# Altium project PCB_BTL.PrjPcb
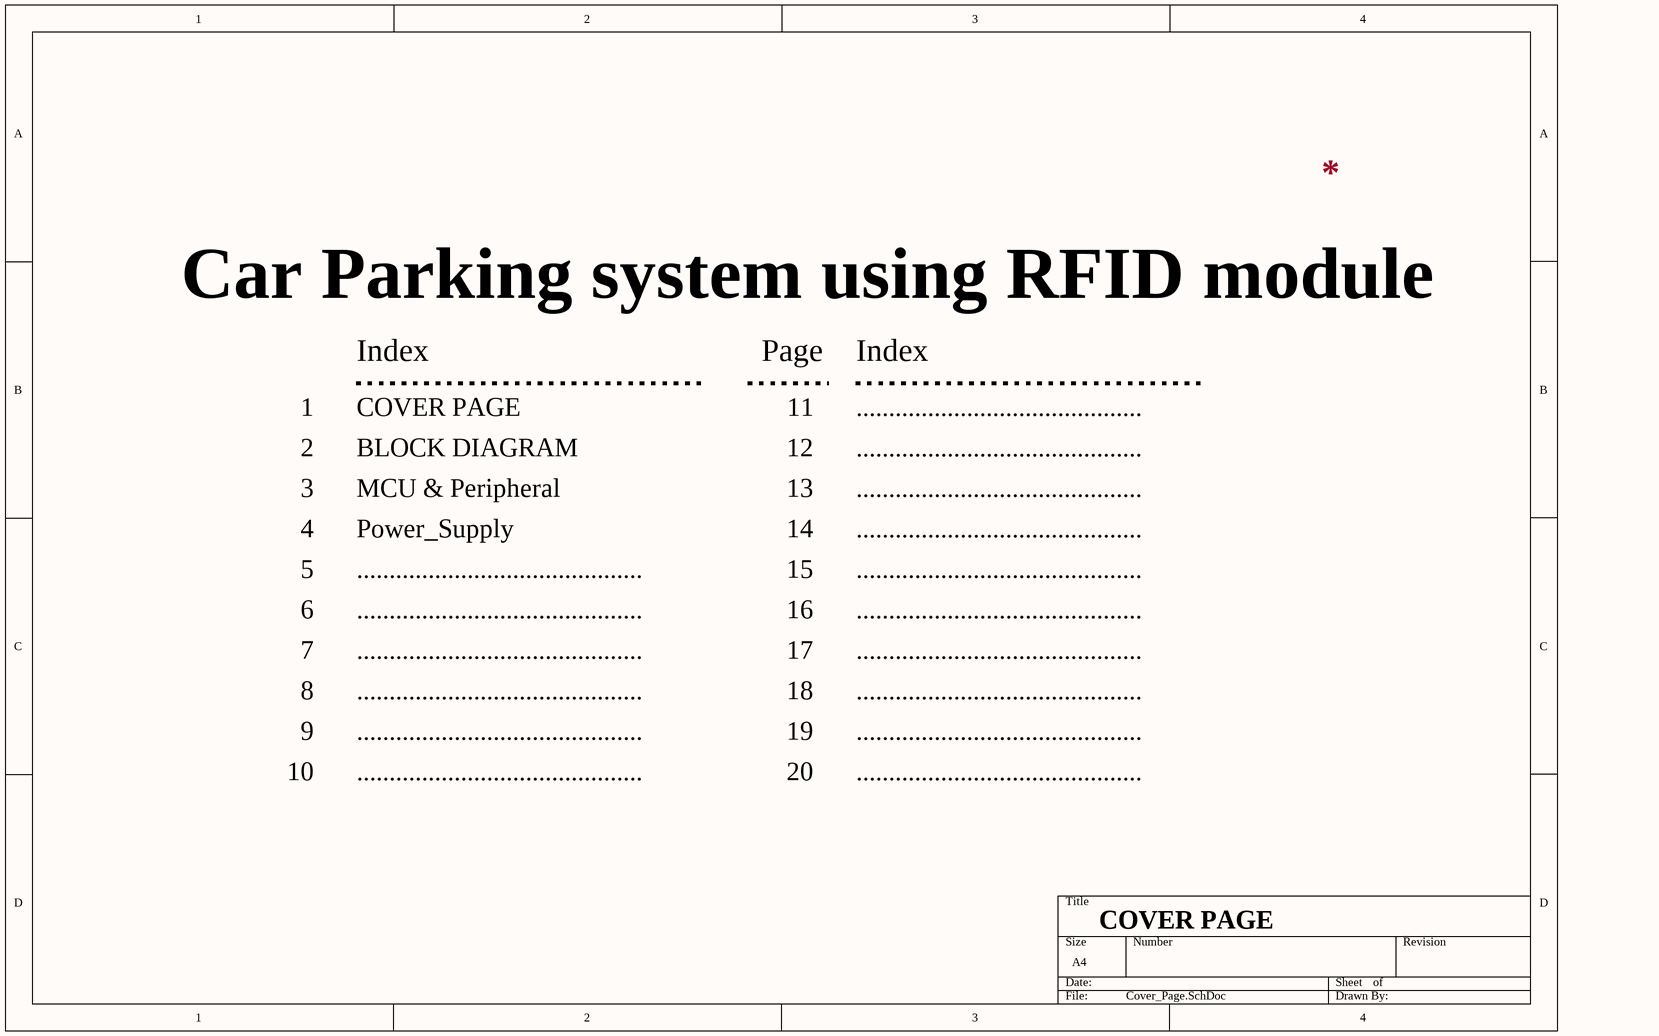
[diagram p0: Cover_Page.SchDoc]
3 sheets, 50 parts. Net scope: global (net labels, ports and power ports of the same name join across sheets).
Board file: BTL.PcbDoc
Sheets:
  Cover_Page.SchDoc
  MCU & Peripherals.SchDoc
  Power Supply.SchDoc

## Sheet Cover_Page.SchDoc
size A4; SheetNumber: 1; SheetTotal: 4

### Notes on the sheet
- Car Parking system using RFID module
- Index
- Page
- 1
- COVER PAGE
- 11
- ............................................
- 2
- 3
- BLOCK DIAGRAM
- MCU & Peripheral
- 12
- 13
- 4
- 5
- Power_Supply
- 14
- 15
- 6
- 16
- 7
- 8
- 17
- 18
- 9
- 10
- 19
- 20

## Sheet MCU & Peripherals.SchDoc: STM32 Blue Pill
size A3; ApprovedBy: Bui Quoc Bao; SheetNumber: 3; SheetTotal: 4; SPICEModelCacheVQOZSIKY: <root> / <DocumentId>VQOZSIKY</DocumentId> / <CacheFrame Number="0"> / <Model Name="0805_885012207072_100nf" Kind="CKT"> / <Text>******* / .subckt 0805_885012207072_100nF 1 2 / Rser 1 3 0.0172819633028 / Lser 2 4 0.00000000035 / C1 3 4 0.0000001 / Rpar 3 4 5000000000 / .ends 0805_885012207072_100nF</Text> / </Model> / <Model Name="0805_885012007030_22pf" Kind="CKT"> / <Text>******* / .subckt 0805_885012007030_22pF 1 2 / Rser 1 3 0.337501541959 / Lser 2 4 6.08362599E-10 / C1 3 4 0.000000000022 / Rpar 3 4 10000000000 / .ends 0805_885012007030_22pF</Text> / </Model> / <Model Name="0805_885012107015_1uf" Kind="CKT"> / <Text>******* / .subckt 0805_885012107015_1uF 1 2 / Rser 1 3 0.00799934804354 / Lser 2 4 2.55135429E-10 / C1 3 4 0.000001 / Rpar 3 4 500000000 / .ends 0805_885012107015_1uF</Text> / </Model> / <Model Name="0805_885012207068_22nf" Kind="CKT"> / <Text>******* / .subckt 0805_885012207068_22nF 1 2 / Rser 1 3 0.0486328028818 / Lser 2 4 0.00000000041 / C1 3 4 0.000000022 / Rpar 3 4 10000000000 / .ends 0805_885012207068_22nF</Text> / </Model> / </CacheFrame> / </root>
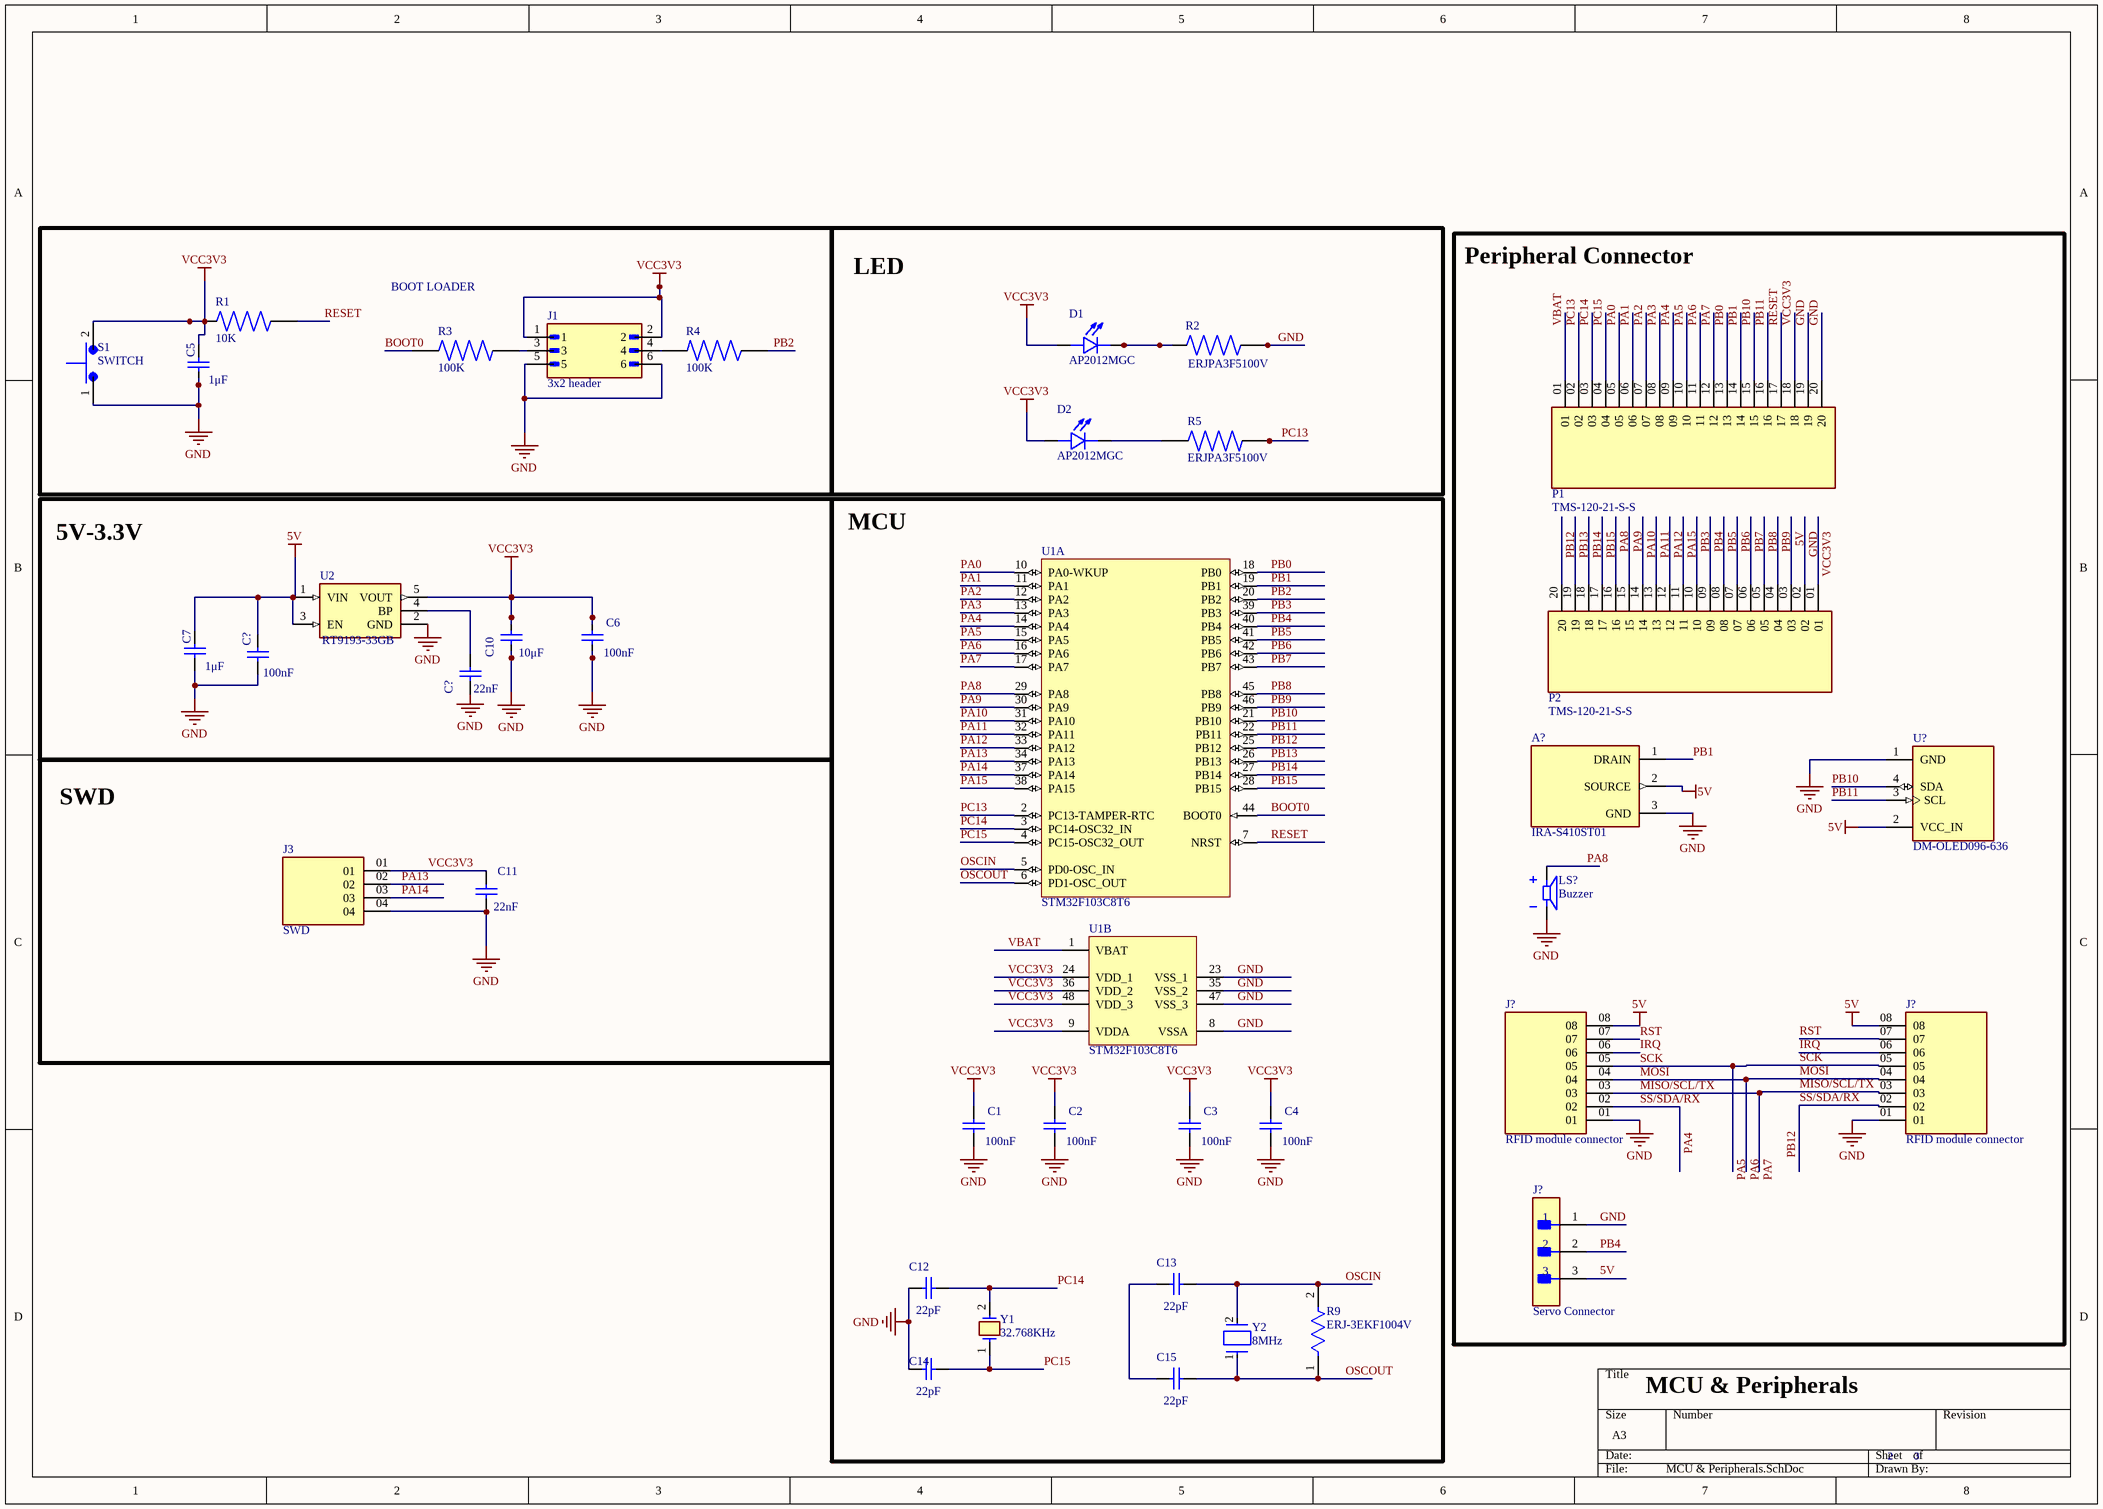
[diagram p1: MCU & Peripherals.SchDoc]

### Parts
(Parts that share a designator on the sheet are numbered #1, #2 ... from top to bottom, then left to right.)
A?  IRA-S410ST01  [TO254P940H490-3]
C1  100nF  [WCAP-CSGP_0805_L2W1.25H0.8_Reflow]
C2  100nF  [WCAP-CSGP_0805_L2W1.25H0.8_Reflow]
C3  100nF  [WCAP-CSGP_0805_L2W1.25H0.8_Reflow]
C4  100nF  [WCAP-CSGP_0805_L2W1.25H0.8_Reflow]
C5  1μF  [WCAP-CSGP_0805_L2W1.25H1.25]
C6  100nF  [WCAP-CSGP_0805_L2W1.25H0.8_Reflow]
C7  1μF  [WCAP-CSGP_0805_L2W1.25H1.25]
C10  10μF  [WCAP-CSGP_0805_L2W1.25H1.25]
C11  22nF  [WCAP-CSGP_0805_L2W1.25H0.8_Reflow]
C12  22pF  [WCAP-CSGP_0805_L2W1.25H0.6_Reflow]
C13  22pF  [WCAP-CSGP_0805_L2W1.25H0.6_Reflow]
C14  22pF  [WCAP-CSGP_0805_L2W1.25H0.6_Reflow]
C15  22pF  [WCAP-CSGP_0805_L2W1.25H0.6_Reflow]
C?#1  100nF  [WCAP-CSGP_0805_L2W1.25H0.8_Reflow]
C?#2  22nF  [WCAP-CSGP_0805_L2W1.25H0.8_Reflow]
D1  AP2012MGC  [LED_AP2012MGC]
D2  AP2012MGC  [LED_AP2012MGC]
J1  3x2 header  [HARWIN_M20-9980346]
J3  SWD  [SAMTEC_TSW-204-16-G-S-RA]
J?#1  RFID module connector  [SAMTEC_SL-108-T-19]
J?#2  RFID module connector  [SAMTEC_SL-108-T-19]
J?#3  Servo Connector  [FP-M22-2010305-MFG]
LS?  Buzzer  [XDCR_CMI-1210-5-95T]
P1  TMS-120-21-S-S  [SAMTEC_TMS-120-21-S-S]
P2  TMS-120-21-S-S  [SAMTEC_TMS-120-21-S-S]
R1  10K  [RESC2012X60N]
R2  ERJPA3F5100V  [RES_ERJPA3F5100V]
R3  100K  [RESC2012X60N]
R4  100K  [RESC2012X60N]
R5  ERJPA3F5100V  [RES_ERJPA3F5100V]
R9  ERJ-3EKF1004V  [FP-ERJ3EK-IPC_C]
S1  SWITCH  [SW_TS10-63-26-BE-250-SMT-TR]
U1  STM32F103C8T6  [STM-LQFP48_L]  (parts A,B of 2)
U2  RT9193-33GB  [SOT94P279X129-5N]
U?#1  DM-OLED096-636  [MODULE_DM-OLED096-636]
Y1  32.768KHz  [XTAL_NX3215SA-32.768K-STD-MUA-14]
Y2  8MHz  [FP-ABLS-MFG]

### Blocks framed on the sheet
BOOT LOADER: C5 J1 R1 R3 R4 S1
LED: D1 D2 R2 R5
Peripheral Connector: A? J?#1-J?#3 LS? P1 P2 U?#1
5V-3.3V: C6 C7 C10 C?#1 C?#2 U2
MCU: C1-C4 C12-C15 R9 U1 Y1 Y2
SWD: C11 J3

### Nets
5V: A?.2(SOURCE) C7.2 C?#1.2 J?#1.08 J?#2.08 P2.03 U2.1(VIN) U2.3(EN) U?#1.2(VCC_IN)
GND: A?.3(GND) C1.1 C2.1 C3.1 C4.1 C5.1 C6.1 C7.1 C10.1 C11.1 C12.1 C14.1 C?#1.1 J1.5 J1.6 J3.04 J?#1.01 J?#2.01 J?#3.1 LS?.N P1.19 P1.20 P2.02 R2.2 S1.1 U1.8(VSSA) U1.23(VSS_1) U1.35(VSS_2) U1.47(VSS_3) U2.2(GND) U?#1.1(GND)
VCC3V3: C1.2 C2.2 C3.2 C4.2 C5.2 C6.2 C10.2 C11.2 D1.A D2.A J1.1 J1.2 J3.01 P1.18 P2.01 R1.2 S1.2 U1.9(VDDA) U1.24(VDD_1) U1.36(VDD_2) U1.48(VDD_3) U2.5(VOUT)
BOOT0: R3.1 U1.44(BOOT0)
IRQ: J?#1.06 J?#2.06
MISO/SCL/TX: J?#1.03 J?#2.03 P1.12 U1.17(PA7)  [also labelled PA7]
MOSI: J?#1.04 J?#2.04 P1.11 U1.16(PA6)  [also labelled PA6]
OSCIN: C13.2 R9.2 U1.5(PD0-OSC_IN) Y2.2
OSCOUT: C15.2 R9.1 U1.6(PD1-OSC_OUT) Y2.1
PA0: P1.05 U1.10(PA0-WKUP)
PA1: P1.06 U1.11(PA1)
PA2: P1.07 U1.12(PA2)
PA3: P1.08 U1.13(PA3)
PA4: J?#1.02 J?#2.02 P1.09 P2.20 U1.14(PA4) U1.25(PB12)  [also labelled PB12, SS/SDA/RX]
PA5: J?#1.05 J?#2.05 P1.10 U1.15(PA5)  [also labelled SCK]
PA8: LS?.P P2.16 U1.29(PA8)
PA9: P2.15 U1.30(PA9)
PA10: P2.14 U1.31(PA10)
PA11: P2.13 U1.32(PA11)
PA12: P2.12 U1.33(PA12)
PA13: J3.02 U1.34(PA13)
PA14: J3.03 U1.37(PA14)
PA15: P2.11 U1.38(PA15)
PB0: P1.13 U1.18(PB0)
PB1: A?.1(DRAIN) P1.14 U1.19(PB1)
PB2: R4.2 U1.20(PB2)
PB3: P2.10 U1.39(PB3)
PB4: J?#3.2 P2.09 U1.40(PB4)
PB5: P2.08 U1.41(PB5)
PB6: P2.07 U1.42(PB6)
PB7: P2.06 U1.43(PB7)
PB8: P2.05 U1.45(PB8)
PB9: P2.04 U1.46(PB9)
PB10: P1.15 U1.21(PB10) U?#1.4(SDA)
PB11: P1.16 U1.22(PB11) U?#1.3(SCL)
PB13: P2.19 U1.26(PB13)
PB14: P2.18 U1.27(PB14)
PB15: P2.17 U1.28(PB15)
PC13: P1.02 R5.2 U1.2(PC13-TAMPER-RTC)
PC14: C12.2 P1.03 U1.3(PC14-OSC32_IN) Y1.2
PC15: C14.2 P1.04 U1.4(PC15-OSC32_OUT) Y1.1
RESET: P1.17 R1.1 U1.7(NRST)
RST: J?#1.07 J?#2.07
VBAT: P1.01 U1.1(VBAT)
NetC13_1: C13.1 C15.1
NetC?#2_2: C?#2.2 U2.4(BP)
NetD1_C: D1.C R2.1
NetD2_C: D2.C R5.1
NetJ1_3: J1.3 R3.2
NetJ1_4: J1.4 R4.1

Not connected (* = marked no-connect by the designer): C?#2 1; J?#3 3

### Notes on the sheet
- MCU & Peripherals
- 2
- 3
- Labels drawn without touching a wire or pin: 5V, GND

### Library data of the parts
A? = IRA-S410ST01: Sensor PIR (Passive Infrared) Motion Sensing Radial, Metal Can, Lensed - 3 Lead; MF: Murata; Arrow_Electronics-Purchase-URL: https://snapeda.com/shop?store=Arrow+Electronics&id=4970504; Availability: Bad; DigiKey-Purchase-URL: https://snapeda.com/shop?store=DigiKey&id=4970504; Package: Radial-3 Murata; Price: None; Mouser-Purchase-URL: https://snapeda.com/shop?store=Mouser&id=4970504; MP: IRA-S410ST01; SnapEDA_Link: https://www.snapeda.com/parts/IRA-S410ST01/Murata/view-part/4970504/?ref=snap; Value: *
C1-C4 C6 C?#1 = 885012207072: WCAP-CSGP Multilayer Ceramic Chip Capacitor, General Purpose, size 0805, X7R, 100nF, 25V; Manufacturer: Wurth Elektronik; Case/Size Code: 0805; Capacitance Tolerance: +/-10%; Dissipation Factor: 3.5%; Insulation Resistance: 5GΩ; Technical Reference: X7R0805104K025DFCT10000; Manufacturer Part Number: 885012207072; Category: Multilayer Ceramic Chip Capacitors; Match Code: WCAP-CSGP; ComponentLink1Description: Website Link; ComponentLink1URL: https://www.we-online.com/redexpert/article/885012207072?ad; ComponentLink2Description: Datasheet Link; ComponentLink2URL: https://www.we-online.com/redexpert/spec/885012207072?ad; Mount: Surface Mount; Min Operating Temperature: -55°C; Max Operating Temperature: 125°C; Packaging: Tape and Reel; Length: 2mm; Width: 1.25mm; Height: 0.8mm; Capacitance: 100nF; Ceramic Type: X7R; Rated Voltage (DC): 25V
C5 C7 = 885012107015: WCAP-CSGP Multilayer Ceramic Chip Capacitor, General Purpose, size 0805, X5R, 1μF, 25V; Manufacturer: Wurth Elektronik; Case/Size Code: 0805; Capacitance Tolerance: +/-20%; Dissipation Factor: 5%; Insulation Resistance: 0.5GΩ; Technical Reference: X5R0805105M025DFCT10000; Manufacturer Part Number: 885012107015; Category: Multilayer Ceramic Chip Capacitors; Match Code: WCAP-CSGP; ComponentLink1Description: Website Link; ComponentLink1URL: https://www.we-online.com/redexpert/article/885012107015?ad; ComponentLink2Description: Datasheet Link; ComponentLink2URL: https://www.we-online.com/redexpert/spec/885012107015?ad; Mount: Surface Mount; Min Operating Temperature: -55°C; Max Operating Temperature: 85°C; Packaging: Tape and Reel; Length: 2mm; Width: 1.25mm; Height: 1.25mm; Capacitance: 1μF; Ceramic Type: X5R; Rated Voltage (DC): 25V
C10 = 885012107027: WCAP-CSGP Multilayer Ceramic Chip Capacitor, General Purpose, size 0805, X5R Class II, 10μF, 25V; Manufacturer: Wurth Elektronik; Case/Size Code: 0805; Capacitance Tolerance: +/-10%; Dissipation Factor: 12.5%; Insulation Resistance: 0.005GΩ; Technical Reference: X5R0805106K025DFCT10000; Manufacturer Part Number: 885012107027; Category: Multilayer Ceramic Chip Capacitors; Match Code: WCAP-CSGP; ComponentLink1Description: Website Link; ComponentLink1URL: https://www.we-online.com/redexpert/article/885012107027?ad; ComponentLink2Description: Datasheet Link; ComponentLink2URL: https://www.we-online.com/redexpert/spec/885012107027?ad; Mount: Surface Mount; Min Operating Temperature: -55°C; Max Operating Temperature: 85°C; Packaging: Tape and Reel; Length: 2mm; Width: 1.25mm; Height: 1.25mm; Capacitance: 10μF; Ceramic Type: X5R Class II; Rated Voltage (DC): 25V
C11 C?#2 = 885012207068: WCAP-CSGP Multilayer Ceramic Chip Capacitor, General Purpose, size 0805, X7R, 22nF, 25V; Manufacturer: Wurth Elektronik; Case/Size Code: 0805; Capacitance Tolerance: +/-10%; Dissipation Factor: 3.5%; Insulation Resistance: 10GΩ; Technical Reference: X7R0805223K025DFCT10000; Manufacturer Part Number: 885012207068; Category: Multilayer Ceramic Chip Capacitors; Match Code: WCAP-CSGP; ComponentLink1Description: Website Link; ComponentLink1URL: https://www.we-online.com/redexpert/article/885012207068?ad; ComponentLink2Description: Datasheet Link; ComponentLink2URL: https://www.we-online.com/redexpert/spec/885012207068?ad; Mount: Surface Mount; Min Operating Temperature: -55°C; Max Operating Temperature: 125°C; Packaging: Tape and Reel; Length: 2mm; Width: 1.25mm; Height: 0.8mm; Capacitance: 22nF; Ceramic Type: X7R; Rated Voltage (DC): 25V
C12-C15 = 885012007030: WCAP-CSGP Multilayer Ceramic Chip Capacitor, General Purpose, size 0805, NP0, 22pF, 25V; Manufacturer: Wurth Elektronik; Case/Size Code: 0805; Capacitance Tolerance: +/-5%; Insulation Resistance: 10GΩ; Q Factor: 840; Technical Reference: NP00805220J025DFCT10000; Manufacturer Part Number: 885012007030; Category: Multilayer Ceramic Chip Capacitors; Match Code: WCAP-CSGP; ComponentLink1Description: Website Link; ComponentLink1URL: https://www.we-online.com/redexpert/article/885012007030?ad; ComponentLink2Description: Datasheet Link; ComponentLink2URL: https://www.we-online.com/redexpert/spec/885012007030?ad; Mount: Surface Mount; Min Operating Temperature: -55°C; Max Operating Temperature: 125°C; Packaging: Tape and Reel; Length: 2mm; Width: 1.25mm; Height: 0.6mm; Capacitance: 22pF; Ceramic Type: NP0; Rated Voltage (DC): 25V
D1 D2 = AP2012MGC: Green 2 x 1.25 x 1.1 mm 120Â° Water Clear 70 mcd 2.1 V Chip LED Lamp SMT; MF: Kingbright; SnapEDA_Link: https://www.snapeda.com/parts/AP2012MGC/Kingbright/view-part/?ref=snap; Package: 0805 Kingbright; Value: *; MP: AP2012MGC; Check_prices: https://www.snapeda.com/parts/AP2012MGC/Kingbright/view-part/?ref=eda
J1 = M20-9980346: Package: None; Price: None; Value: *; MP: M20-9980346; Availability: Unavailable
J3 = TSW-204-16-G-S-RA: Connector Header Through Hole, Right Angle 4 position 0.200 (5.08mm); MF: Samtec; SnapEDA_Link: https://www.snapeda.com/parts/TSW-204-16-G-S-RA/Samtec/view-part/?ref=snap; Package: None; Value: *; MP: TSW-204-16-G-S-RA; Check_prices: https://www.snapeda.com/parts/TSW-204-16-G-S-RA/Samtec/view-part/?ref=eda
J?#1 J?#2 = SL-108-T-19: Package: None; Price: None; Value: *; MP: SL-108-T-19; Availability: Unavailable
J?#3 = CMP-15831-000100-1: CONN HEADER VERT 3POS 2MM; Voltage Rating (AC): 250V; Current Rating: 1A; Contact Resistance: 20mR; Number of Positions: 3; Mated Stacking Heights: 8.6mm; Voltage Rating: 650V; Insulation Resistance: 10GR; Connector Type: Male Pin; Contact Shape: Square; Min Operating Temperature: -55°C; Lead Pitch: 2mm; Contact Plating: Gold; Pitch: 2mm; Max Operating Temperature: 105°C; Color: Black; Series: M22; Orientation: Straight; Number of Contacts: 3; Max Current Rating: 1A; Contact Material: Bronze; Packaging: Bulk; Housing Color: Black; Housing Material: Nylon; Mount: Through Hole; Case/Package: SIL; Working Voltage: 250V; Reach SVHC Compliant: Yes; Number of Rows: 1; Package Quantity: 1000; Insulation Material: Nylon; Length: 6mm; Contact Finish - Mating: GOLD; Depth: 2mm; Contact Type: Male Pin; Insulation Color: Black; Termination: Solder; RoHS Compliant: Yes; Radiation Hardening: No; Flammability Rating: UL94 V-0; Contact Mating Length: 0.138inch; Fastening Type: Pull
LS? = CMI-1210-5-95T: MP: CMI-1210-5-95T; Availability: Unavailable; Package: None; Value: *; Price: None
R1 = RC0805FR-0710KL: 10 kOhms Â±1% 0.125W, 1/8W Chip Resistor 0805 (2012 Metric) Moisture Resistant Thick Film; MF: Yageo; Value: *; SnapEDA_Link: https://www.snapeda.com/parts/RC0805FR-0710KL/Yageo/view-part/?ref=snap; Purchase-URL: https://pricing.snapeda.com/search/part/RC0805FR-0710KL/?ref=eda; Availability: In Stock; Price: None; Package: 2012 Rohm Semiconductor; Check_prices: https://www.snapeda.com/parts/RC0805FR-0710KL/Yageo/view-part/?ref=eda; MP: RC0805FR-0710KL
R2 R5 = ERJPA3F5100V: RES, THICK FILM, 510R, 1%, 0.25W, 0603; MF: Panasonic; MP: ERJ-PA3F5100V; SnapEDA_Link: https://www.snapeda.com/parts/ERJ-PA3F5100V/Panasonic/view-part/?ref=snap; Package: 1608-2 Panasonic; Value: *; Check_prices: https://www.snapeda.com/parts/ERJ-PA3F5100V/Panasonic/view-part/?ref=eda
R3 R4 = RC0805FR-07100KL: 100 kOhms Â±1% 0.125W, 1/8W Chip Resistor 0805 (2012 Metric) Moisture Resistant Thick Film; MF: Yageo; SnapEDA_Link: https://www.snapeda.com/parts/RC0805FR-07100KL/Yageo/view-part/?ref=snap; Package: 2012 Yageo; Value: *; MP: RC0805FR-07100KL; Check_prices: https://www.snapeda.com/parts/RC0805FR-07100KL/Yageo/view-part/?ref=eda
R9 = CMP-1012-00849-3: RES SMD 1M OHM 1% 1/10W 0603; Resistance: 1MR; Voltage Rating: 75V; Temperature Coefficient: 100ppm/°C; Power Rating: 100mW; REACH SVHC: No SVHC; Radiation Hardening: No; Features: Automotive AEC-Q200; Case Code (Metric): 1608; Resistance Tolerance: 1%; Case/Package: 0603; Termination: SMD/SMT; Max Operating Temperature: 155°C; Tolerance: 1%; Size Code: 0603; Case Code (Imperial): 0603; Min Operating Temperature: -55°C; Number of Pins: 2; Mount: Surface Mount; Package Quantity: 1; Military Standard: Not; Voltage Rating (DC): 75V; Depth: 0.8mm; Packaging: Tape and Reel; Width: 0.8mm; Number of Terminations: 2; Length: 1.6mm; Height: 0.022inch; RoHS Compliant: Yes; Resistor Type: Thick Film; Contact Plating: Tin; Lead Free: Lead Free; Series: ERJ; Construction: Rectangular; Max Power Dissipation: 100mW
S1 = TS10-63-26-BE-250-SMT-TR: 6.1 x 3.8 mm, 2.6 mm Actuator Height, 250 gf, Surface Mount, SPST, Tactile Switch; MF: Same Sky; SnapEDA_Link: https://www.snapeda.com/parts/TS10-63-26-BE-250-SMT-TR/Same+Sky/view-part/?ref=snap; Package: None; Value: *; MP: TS10-63-26-BE-250-SMT-TR; Check_prices: https://www.snapeda.com/parts/TS10-63-26-BE-250-SMT-TR/Same+Sky/view-part/?ref=eda
U1 = CMP-0237-00215-3: ARM Cortex-M3 32-bit MCU, 64 KB Flash, 20 KB Internal RAM, 37 I/Os, 48-pin LQFP, -40 to 85 degC, Tray; Supply Voltage(Vcc) min (V): 2; Internal RAM Size (kB): 20; FLASH Size (Prog) (kB): 64; A/D Converter: 2x12-bit (10 Channel); I/Os (High Current): 37; Operating Frequency(F) (Processor speed) (MHz): 72; Core: ARM Cortex-M3; ComponentLink3Description: Package Specification; Mounting Technology: Surface Mount; PartNumber: STM32F103C8T6; PackageReference: LQFP48; Packing: Tray; ComponentLink3URL: http://www.st.com/st-web-ui/static/active/en/resource/technical/document/datasheet/DM00058181.pdf; DatasheetVersion: Rev. 16; ComponentLink1URL: http://www.st.com/web/en/home.html; PackageVersion: Rev. 6, 06/2013; ComponentLink2URL: http://www.st.com/st-web-ui/static/active/en/resource/technical/document/datasheet/CD00161566.pdf; ComponentLink1Description: Manufacturer URL; ComponentLink2Description: Datasheet; PackageDescription: 48-Pin Low Profile Quad Flat Package, 7 x 7 mm Body, 0.5 mm Pitch
U2 = RT9193-33GB: Linear Voltage Regulator IC Positive Fixed 1 Output 300mA TSOT-23-5; MF: Richtek USA; SnapEDA_Link: https://www.snapeda.com/parts/RT9193-33GB/Richtek+USA+Inc./view-part/?ref=snap; Package: SOT-23-5 Richtek; MP: RT9193-33GB; Check_prices: https://www.snapeda.com/parts/RT9193-33GB/Richtek+USA+Inc./view-part/?ref=eda; Purchase-URL: https://pricing.snapeda.com/search/part/RT9193-33GB/?ref=eda; Digi-Key_Part_Number: 1028-1014-2-ND; Value: *
U?#1 = DM-OLED096-636: 0.96â€ 128 X 64 MONOCHROME GRAPHIC OLED DISPLAY MODULE - I2C; SnapEDA_Link: https://www.snapeda.com/parts/DM-OLED096-636/Display+Module/view-part/?ref=snap; Package: Package; Value: *; MF: Display Module; MP: DM-OLED096-636; Check_prices: https://www.snapeda.com/parts/DM-OLED096-636/Display+Module/view-part/?ref=eda
Y1 = NX3215SA-32.768K-STD-MUA-14: 32.768kHz Â±20ppm Crystal 6pF 70 kOhms 2-SMD, No Lead  MANUFACTURER: NIHON DEMPA KOGYO; Availability: Unavailable; Package: None; MP: NX3215SA-32.768K-STD-MUA-14; Value: *; Price: None
Y2 = CMP-27762-009874-1: CRYSTAL 8.0000MHZ 18PF SMD; ESR (Equivalent Series Resistance): 80R; Frequency Stability: 50ppm; Tolerance: 20ppm; Min Operating Temperature: -20°C; Lead Free: Lead Free; Operating Frequency: 8 MHz; Width: 4.7mm; Packaging: Tape and Reel; Series: ABLS; Accuracy: 20ppm; Length: 11.4mm; Frequency Tolerance: 20ppm; Termination: SMD/SMT; Number of Pins: 2; Radiation Hardening: No; Depth: 4.7mm; REACH SVHC: No SVHC; Contact Plating: Tin; Load Capacitance: 18pF; Case/Package: SMD/SMT; Mount: Surface Mount; Package Quantity: 1000; Max Operating Temperature: 70°C; Height: 0.165inch; Frequency: 8MHz; Series Resistance: 80R
P1 P2 = TMS-120-21-S-S: Package: None; Price: None; Value: *; MP: TMS-120-21-S-S; Availability: Unavailable

## Sheet Power Supply.SchDoc
size A3; SheetNumber: 3; SheetTotal: 3; SPICEModelCachePMWPNHZN: <root> / <DocumentId>PMWPNHZN</DocumentId> / <CacheFrame Number="0"> / <Model Name="0805_885012107015_1uf" Kind="CKT"> / <Text>******* / .subckt 0805_885012107015_1uF 1 2 / Rser 1 3 0.00799934804354 / Lser 2 4 2.55135429E-10 / C1 3 4 0.000001 / Rpar 3 4 500000000 / .ends 0805_885012107015_1uF</Text> / </Model> / <Model Name="0805_885012207068_22nf" Kind="CKT"> / <Text>******* / .subckt 0805_885012207068_22nF 1 2 / Rser 1 3 0.0486328028818 / Lser 2 4 0.00000000041 / C1 3 4 0.000000022 / Rpar 3 4 10000000000 / .ends 0805_885012207068_22nF</Text> / </Model> / <Model Name="0805_885012207072_100nf" Kind="CKT"> / <Text>******* / .subckt 0805_885012207072_100nF 1 2 / Rser 1 3 0.0172819633028 / Lser 2 4 0.00000000035 / C1 3 4 0.0000001 / Rpar 3 4 5000000000 / .ends 0805_885012207072_100nF</Text> / </Model> / </CacheFrame> / </root>
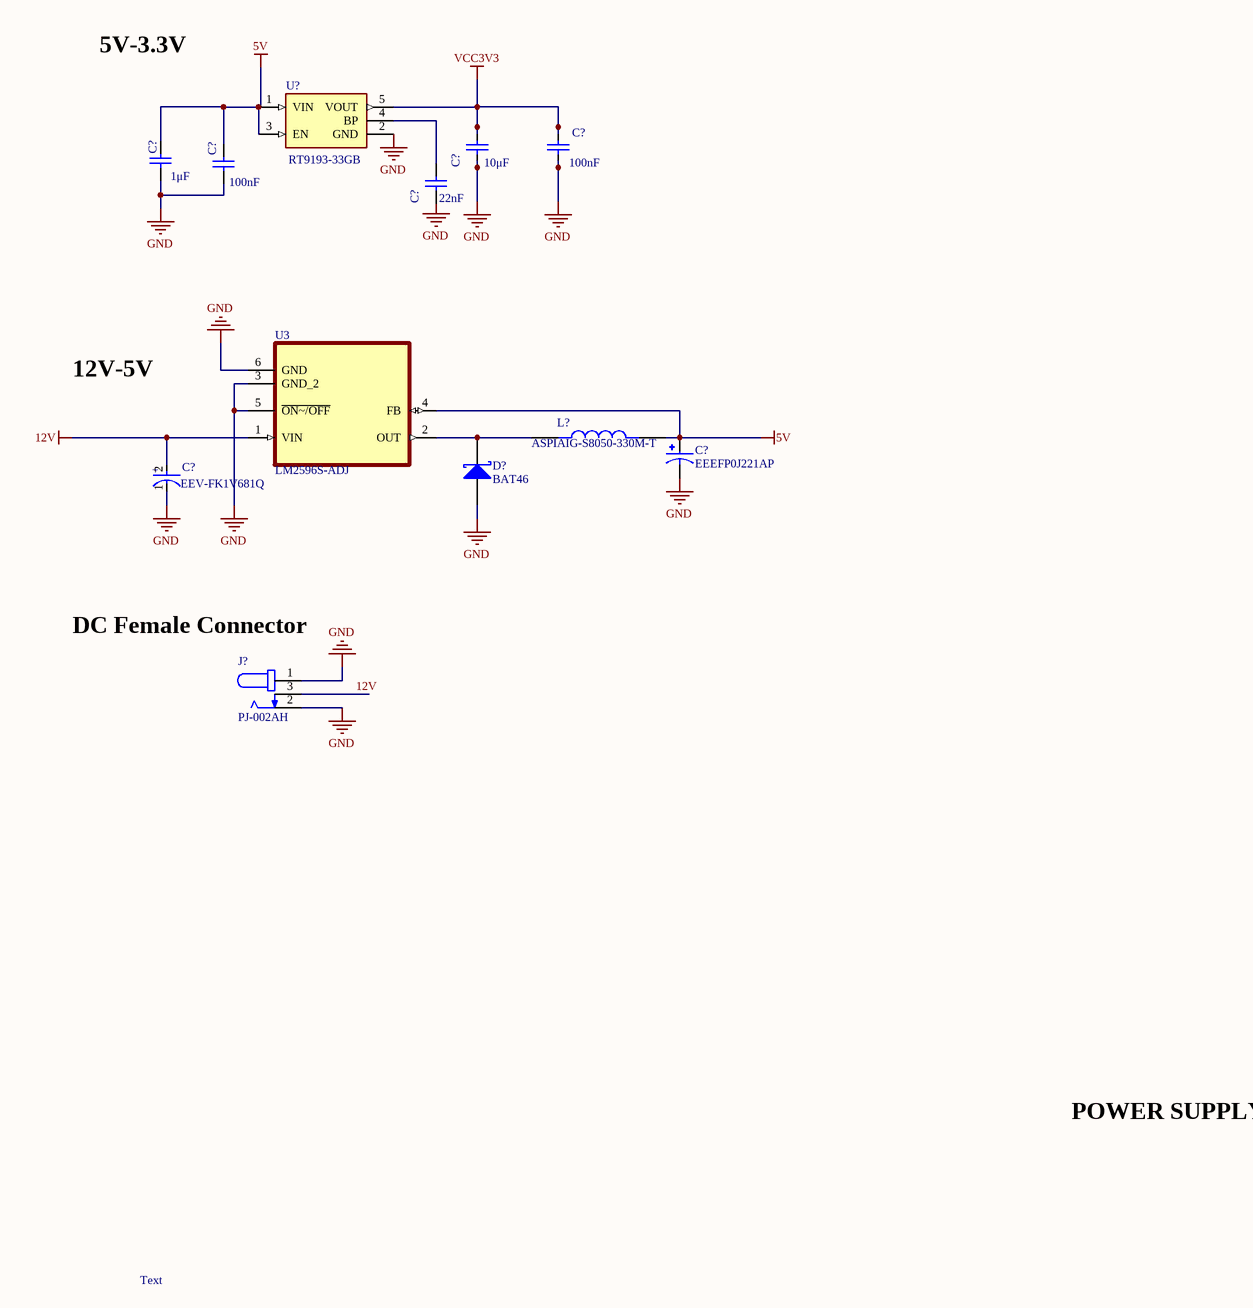
[diagram p2: Power Supply.SchDoc]

### Parts
(Parts that share a designator on the sheet are numbered #1, #2 ... from top to bottom, then left to right.)
C?#3  10μF  [WCAP-CSGP_0805_L2W1.25H1.25]
C?#4  100nF  [WCAP-CSGP_0805_L2W1.25H0.8_Reflow]
C?#5  1μF  [WCAP-CSGP_0805_L2W1.25H1.25]
C?#6  100nF  [WCAP-CSGP_0805_L2W1.25H0.8_Reflow]
C?#7  22nF  [WCAP-CSGP_0805_L2W1.25H0.8_Reflow]
C?#8  EEEFP0J221AP  [CAP_EEEFP0J221AP]
C?#9  EEV-FK1V681Q  [FP-FKH13-MFG]
D?  BAT46  [STM-DO-35-2]
J?#4  PJ-002AH  [CUI_PJ-002AH]
L?  ASPIAIG-S8050-330M-T  [IND_ASPIAIG-S8050-330M-T]
U3  LM2596S-ADJ  [TO170P1435X465-6N]
U?#2  RT9193-33GB  [SOT94P279X129-5N]

### Nets
5V: C?#5.2 C?#6.2 C?#8.1 L?.2 U3.4(FB) U?#2.1(VIN) U?#2.3(EN)
12V: C?#9.2(A) J?#4.3 U3.1(VIN)
GND: C?#3.1 C?#4.1 C?#5.1 C?#6.1 C?#8.2 C?#9.1(C) D?.1(A) J?#4.1 J?#4.2 U3.3(GND_2) U3.5(~{ON~/OFF}) U3.6(GND) U?#2.2(GND)
VCC3V3: C?#3.2 C?#4.2 U?#2.5(VOUT)
NetC?#7_2: C?#7.2 U?#2.4(BP)
NetD?_2: D?.2(K) L?.1 U3.2(OUT)

Not connected (* = marked no-connect by the designer): C?#7 1

### Notes on the sheet
- 5V-3.3V
- 12V-5V
- (near J?#4) DC Female Connector
- POWER SUPPLY
- Text
- Labels drawn without touching a wire or pin: GND
- (in symbol CMP-05427-002172-1) +

### Library data of the parts
C?#3 = 885012107027: as C10 on sheet MCU & Peripherals; Manufacturer Part Number: 885012107027; Category: Multilayer Ceramic Chip Capacitors; Match Code: WCAP-CSGP; ComponentLink1Description: Website Link; ComponentLink1URL: https://www.we-online.com/redexpert/article/885012107027?ad; ComponentLink2Description: Datasheet Link; ComponentLink2URL: https://www.we-online.com/redexpert/spec/885012107027?ad; Mount: Surface Mount; Min Operating Temperature: -55°C; Max Operating Temperature: 85°C; Packaging: Tape and Reel; Length: 2mm; Width: 1.25mm; Height: 1.25mm; Capacitance: 10μF; Ceramic Type: X5R Class II; Rated Voltage (DC): 25V
C?#4 C?#6 = 885012207072: as C1 on sheet MCU & Peripherals; Manufacturer Part Number: 885012207072; Category: Multilayer Ceramic Chip Capacitors; Match Code: WCAP-CSGP; ComponentLink1Description: Website Link; ComponentLink1URL: https://www.we-online.com/redexpert/article/885012207072?ad; ComponentLink2Description: Datasheet Link; ComponentLink2URL: https://www.we-online.com/redexpert/spec/885012207072?ad; Mount: Surface Mount; Min Operating Temperature: -55°C; Max Operating Temperature: 125°C; Packaging: Tape and Reel; Length: 2mm; Width: 1.25mm; Height: 0.8mm; Capacitance: 100nF; Ceramic Type: X7R; Rated Voltage (DC): 25V
C?#5 = 885012107015: as C5 on sheet MCU & Peripherals; Manufacturer Part Number: 885012107015; Category: Multilayer Ceramic Chip Capacitors; Match Code: WCAP-CSGP; ComponentLink1Description: Website Link; ComponentLink1URL: https://www.we-online.com/redexpert/article/885012107015?ad; ComponentLink2Description: Datasheet Link; ComponentLink2URL: https://www.we-online.com/redexpert/spec/885012107015?ad; Mount: Surface Mount; Min Operating Temperature: -55°C; Max Operating Temperature: 85°C; Packaging: Tape and Reel; Length: 2mm; Width: 1.25mm; Height: 1.25mm; Capacitance: 1μF; Ceramic Type: X5R; Rated Voltage (DC): 25V
C?#7 = 885012207068: as C11 on sheet MCU & Peripherals; Manufacturer Part Number: 885012207068; Category: Multilayer Ceramic Chip Capacitors; Match Code: WCAP-CSGP; ComponentLink1Description: Website Link; ComponentLink1URL: https://www.we-online.com/redexpert/article/885012207068?ad; ComponentLink2Description: Datasheet Link; ComponentLink2URL: https://www.we-online.com/redexpert/spec/885012207068?ad; Mount: Surface Mount; Min Operating Temperature: -55°C; Max Operating Temperature: 125°C; Packaging: Tape and Reel; Length: 2mm; Width: 1.25mm; Height: 0.8mm; Capacitance: 22nF; Ceramic Type: X7R; Rated Voltage (DC): 25V
C?#8 = EEEFP0J221AP: CAP ALUM 220UF 20% 6.3V SMD; MF: Panasonic; SnapEDA_Link: https://www.snapeda.com/parts/EEEFP0J221AP/Panasonic/view-part/?ref=snap; Package: RADIAL-2 Panasonic; Value: *; MP: EEEFP0J221AP; Check_prices: https://www.snapeda.com/parts/EEEFP0J221AP/Panasonic/view-part/?ref=eda
C?#9 = CMP-05427-002172-1: CAP ALUM 680UF 20% 35V SMD; Ripple Current (AC): 1.1A; Life (Hours): 5000Hour; Material: Aluminium; ESR (Equivalent Series Resistance): 60mR; Leakage Current: 3uA; Max Operating Temperature: 105°C; Min Operating Temperature: -55°C; Reach SVHC Compliant: Yes; Radiation Hardening: No; Length: 14mm; Package Quantity: 200; Width: 900um; Mount: Surface Mount; Ripple Current: 1.1A; Lead Free: Lead Free; Case/Package: Radial; Voltage Rating (DC): 35V; Termination: SMD/SMT; Capacitance: 680uF; Series: FK; Packaging: Tape and Reel; Voltage: 35V; Height: 13.5mm; Construction: Cylindrical; Voltage Rating: 35V; Ratings: AEC-Q200; Contact Plating: Tin; Impedance: 60mR; Height - Seated (Max): 0.531inch; Diameter: 12.5mm; RoHS Compliant: Yes; Tolerance: 20%
D? = CMP-2000-05926-1: Small Signal Schottky Diode, 150 mA, 100 V, -65 to 125 degC, 2-Pin DO-35, RoHS, Tape and Reel; Manufacturer: STMicroelectronics; SVHC: NoSVHC(15-Jun-2015); Diode Configuration: Single; No. of Pins: 2Pins; Forward Surge Current Ifsm Max: 750mA; Repetitive Reverse Voltage Vrrm Max: 100V; Diode Case Style: DO-204AH; Forward Voltage VF Max: 1V; Forward Current If(AV): 150mA; Manufacturer URL: http://www.st.com/; Packaging: Tape&Reel; Package Reference: DO-35-2; Datasheet URL: http://www.st.com/content/ccc/resource/technical/document/datasheet/group1/11/76/e4/a3/df/07/49/14/CD00000767/files/CD00000767.pdf/jcr:content/translations/en.CD00000767.pdf; Diode Type: Schottky; Mounting Technology: ThroughHole; Package Description: 2-Pin Axial Lead, Dia 1.765 mm, Body Length 3.775 mm; Product Range: -; Datasheet Version: Rev. 2.1, 10/2001; Operating Temperature Max: 125°C
J?#4 = PJ-002AH: 2.0 x 6.5 mm, 5.0 A, Horizontal, Through Hole, Dc Power Jack Connector; MF: Same Sky; SnapEDA_Link: https://www.snapeda.com/parts/PJ-002AH/Same+Sky/view-part/?ref=snap; Package: None; Value: *; MP: PJ-002AH; Check_prices: https://www.snapeda.com/parts/PJ-002AH/Same+Sky/view-part/?ref=eda
L? = ASPIAIG-S8050-330M-T: Inductor Power Shielded Wirewound 33uH 20% 100KHz Ferrite 2A 122mOhm DCR 3131 Automotive T/R; MF: Abracon LLC; MP: ASPIAIG-S8050-330M-T; SnapEDA_Link: https://www.snapeda.com/parts/ASPIAIG-S8050-330M-T/Abracon+LLC/view-part/?ref=snap; Value: *; Package: Nonstandard Abracon; Price: None; Availability: In Stock; Purchase-URL: https://pricing.snapeda.com/search/part/ASPIAIG-S8050-330M-T/?ref=eda; Check_prices: https://www.snapeda.com/parts/ASPIAIG-S8050-330M-T/Abracon+LLC/view-part/?ref=eda
U3 = LM2596S-ADJ: Buck Switching Regulator IC Positive Adjustable 1.2V 1 Output 3A TO-263-6, DÂ²Pak (5 Leads + Tab), TO-263BA; MF: UMW; SnapEDA_Link: https://www.snapeda.com/parts/LM2596S-ADJ/Umwelt+Sensor+Teknik/view-part/?ref=snap; Package: None; Value: *; MP: LM2596S-ADJ; Check_prices: https://www.snapeda.com/parts/LM2596S-ADJ/Umwelt+Sensor+Teknik/view-part/?ref=eda
U?#2 = RT9193-33GB: as U2 on sheet MCU & Peripherals; SnapEDA_Link: https://www.snapeda.com/parts/RT9193-33GB/Richtek+USA+Inc./view-part/?ref=snap; Package: SOT-23-5 Richtek; MP: RT9193-33GB; Check_prices: https://www.snapeda.com/parts/RT9193-33GB/Richtek+USA+Inc./view-part/?ref=eda; Purchase-URL: https://pricing.snapeda.com/search/part/RT9193-33GB/?ref=eda; Digi-Key_Part_Number: 1028-1014-2-ND; Value: *

## Nets that join several sheets
5V: MCU & Peripherals (9 pins), Power Supply (7 pins)
GND: MCU & Peripherals (31 pins), Power Supply (13 pins)
VCC3V3: MCU & Peripherals (22 pins), Power Supply (C?#3.2 C?#4.2 U?#2.5)